# Altium schematic sheet GPS.SchDoc
size A
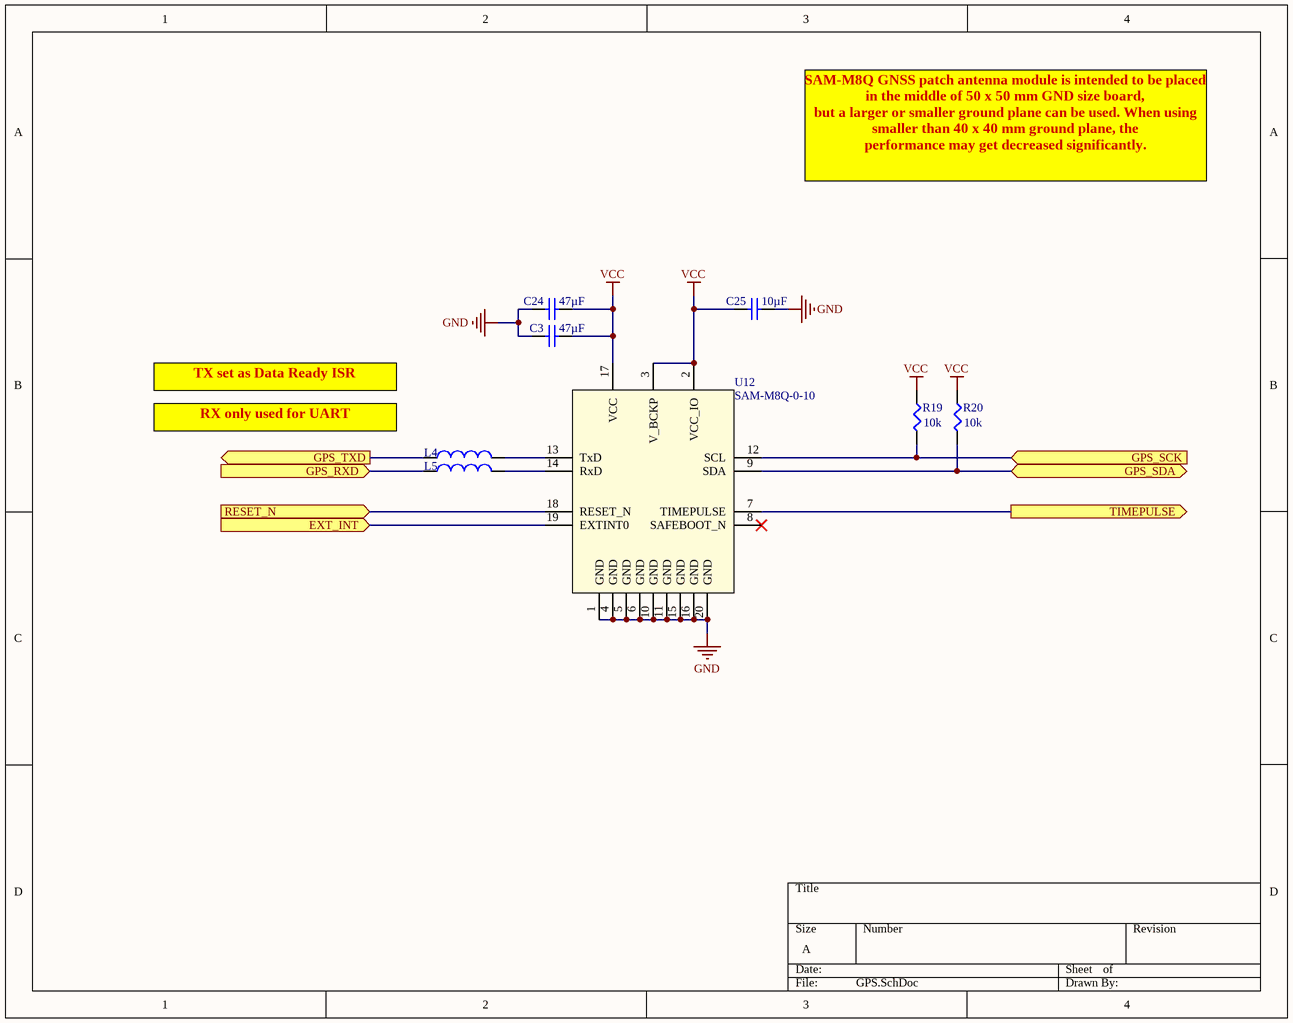
[diagram p0: GPS.SchDoc]

## Parts
C3  Capacitance: 47µF  [C0603N]  (hidden comment: CL21A476MQCLRNC)
C24  Capacitance: 47µF  [C0603N]  (hidden comment: CL21A476MQCLRNC)
C25  Capacitance: 10µF  [C0603N]  (hidden comment: C1608X5R1A106K080AC)
L4  LI0603G221R-10  [R0603L]  (value not drawn)
L5  LI0603G221R-10  [R0603L]  (value not drawn)
R19  value 10k  [SMD-0603-RES]  (hidden comment: ERJ-3EKF1002V)
R20  value 10k  [SMD-0603-RES]  (hidden comment: ERJ-3EKF1002V)
U12  SAM-M8Q-0-10  [SAM-M8Q]

## Ports
EXT_INT (in), GPS_RXD (in), GPS_SCK (in), GPS_SDA (bidir), GPS_TXD (out), RESET_N (in), TIMEPULSE (out)

## Nets
GND: C3.1 C24.1 C25.2 U12.1(GND) U12.4(GND) U12.5(GND) U12.6(GND) U12.10(GND) U12.11(GND) U12.15(GND) U12.16(GND) U12.20(GND)
VCC: C3.2 C24.2 C25.1 R19.1 R20.1 U12.2(VCC_IO) U12.3(V_BCKP) U12.17(VCC)
EXT_INT: U12.19(EXTINT0) ; port EXT_INT
GPS_RXD: L5.1 ; port GPS_RXD
GPS_SCK: R19.2 U12.12(SCL) ; port GPS_SCK
GPS_SDA: R20.2 U12.9(SDA) ; port GPS_SDA
GPS_TXD: L4.1 ; port GPS_TXD
RESET_N: U12.18(RESET_N) ; port RESET_N
TIMEPULSE: U12.7(TIMEPULSE) ; port TIMEPULSE
NetL4_2: L4.2 U12.13(TxD)
NetL5_2: L5.2 U12.14(RxD)

Not connected (* = marked no-connect by the designer): U12 8(SAFEBOOT_N)*

## Notes on the sheet
- SAM‑M8Q GNSS patch antenna module is intended to be placed in the middle of 50 x 50 mm GND size board,
  but a larger or smaller ground plane can be used. When using smaller than 40 x 40 mm ground plane, the
  performance may get decreased significantly.
- RX only used for UART
- TX set as Data Ready ISR

## Library data of the parts
C3 C24 = CAPACITOR_NP: HOUSEPART: NO; POPULATE: 1; TOLERANCE: ±20%; VOLTAGE: 6.3V; Temperature Coefficient: X5R; DeviceName: CL21A476MQCLRNC; LibraryName: MF_Passives; DeviceSetName: CAPACITOR_NP; MPN: CL21A476MQCLRNC; URL: https://octopart.com/cl21a476mqclrnc-samsung-24871259; MF_PARTNUM: CL21A476MQCLRNC
C25 = CAPACITOR_NP: 4.7µF ±10% 10V Ceramic Capacitor X5R 0603; HOUSEPART: NO; POPULATE: 1; DeviceName: C1608X5R1A106K080AC; LibraryName: MF_Passives; DeviceSetName: CAPACITOR_NP; MPN: C1608X5R1A106K080AC; TOLERANCE: ±10%; VOLTAGE: 10V; MF_PARTNUM: C1608X5R1A106K080AC; Temperature Coefficient: X5R
L4 L5 = INDUCTOR: HOUSEPART: NO; POPULATE: 1; LibraryName: MF_Passives; DeviceSetName: INDUCTOR; MPN: LI0603G221R-10; URL: https://www.digikey.com/product-detail/en/laird-signal-integrity-products/LI0603G221R-10/240-2368-1-ND/806728
R19 R20 = ERJ-3EKF1002V: RES SMD 10K OHM 1% 1/10W 0603; Manufacturer: Panasonic Electronic Components; Factory Stock: 0; Unit Price (USD): 0.00379; @ qty: 1500; Minimum Quantity: 1; Power (Watts): 0.1W, 1/10W; Temperature Coefficient: ±100ppm/°C; Part Number: ERJ-3EKF1002V; Datasheets: http://industrial.panasonic.com/www-cgi/jvcr13pz.cgi?E+PZ+3+AOA0002+ERJ3EKF1002V+7+WW; Image: //media.digikey.com/Photos/Panasonic%20Photos/MFG_ERJ-P6W%20Series.jpg; Digi-Key Part Number: P10.0KHCT-ND; Quantity Available: 6703141; Packaging: Cut Tape (CT); Series: ERJ; Part Status: Active; Tolerance: ±1%; Composition: Thick Film; Features: Automotive AEC-Q200; Operating Temperature: -55°C ~ 155°C; Package / Case: 0603 (1608 Metric); Supplier Device Package: 0603; Size / Dimension: 0.063" L x 0.031" W (1.60mm x 0.80mm); Height - Seated (Max): 0.022" (0.55mm); Number of Terminations: 2; Failure Rate: -
U12 = ublox-sam-m8Q: u-Blox M8 Gnss Antenna Module Tc; Octopart URL: https://octopart.com/sam-m8q-0-10-u-blox-88247750; Manufacturer Part Number: SAM-M8Q-0-10; OctopartID: 87e74baf2f475820; Case/Package: SAM-M8Q